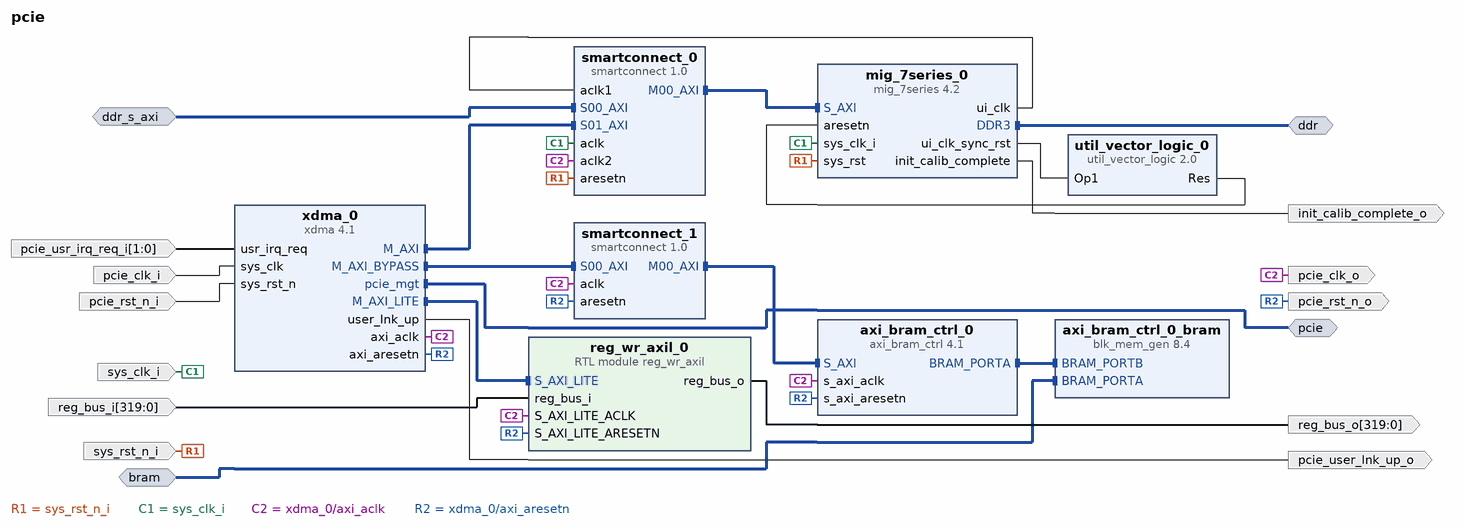
[diagram p0: block diagram of the top level]
# Vivado block design pcie, xc7k325tffg900-2, Vivado 2019.2
create_bd_design pcie

create_bd_intf_port -mode Master -vlnv xilinx.com:interface:ddrx_rtl:1.0 ddr
create_bd_intf_port -mode Master -vlnv xilinx.com:interface:pcie_7x_mgt_rtl:1.0 pcie
create_bd_intf_port -mode Slave -vlnv xilinx.com:interface:bram_rtl:1.0 bram
set_property -dict {CONFIG.MASTER_TYPE BRAM_CTRL} [get_bd_intf_ports bram]
create_bd_intf_port -mode Slave -vlnv xilinx.com:interface:aximm_rtl:1.0 ddr_s_axi
set_property -dict [list \
  CONFIG.DATA_WIDTH 128 \
  CONFIG.PROTOCOL AXI4 \
  CONFIG.FREQ_HZ 200000000 \
  CONFIG.ID_WIDTH 4 \
  CONFIG.ADDR_WIDTH 64 \
  CONFIG.AWUSER_WIDTH 0 \
  CONFIG.ARUSER_WIDTH 0 \
  CONFIG.WUSER_WIDTH 0 \
  CONFIG.RUSER_WIDTH 0 \
  CONFIG.BUSER_WIDTH 0 \
  CONFIG.READ_WRITE_MODE READ_WRITE \
  CONFIG.HAS_BURST 1 \
  CONFIG.HAS_LOCK 1 \
  CONFIG.HAS_PROT 1 \
  CONFIG.HAS_CACHE 1 \
  CONFIG.HAS_QOS 1 \
  CONFIG.HAS_REGION 1 \
  CONFIG.HAS_WSTRB 1 \
  CONFIG.HAS_BRESP 1 \
  CONFIG.HAS_RRESP 1 \
  CONFIG.SUPPORTS_NARROW_BURST 1 \
  CONFIG.NUM_READ_OUTSTANDING 1 \
  CONFIG.NUM_WRITE_OUTSTANDING 1 \
  CONFIG.MAX_BURST_LENGTH 256 \
  CONFIG.NUM_READ_THREADS 1 \
  CONFIG.NUM_WRITE_THREADS 1 \
  CONFIG.RUSER_BITS_PER_BYTE 0 \
  CONFIG.WUSER_BITS_PER_BYTE 0 \
  CONFIG.master_id 0 \
] [get_bd_intf_ports ddr_s_axi]
create_bd_port -dir I -type clk sys_clk_i
set_property -dict {CONFIG.ASSOCIATED_RESET sys_rst_n_i CONFIG.FREQ_HZ 200000000} [get_bd_ports sys_clk_i]
create_bd_port -dir I -type rst sys_rst_n_i
create_bd_port -dir O -type clk pcie_clk_o
create_bd_port -dir O -type rst pcie_rst_n_o
create_bd_port -dir I -from 1 -to 0 pcie_usr_irq_req_i
create_bd_port -dir O init_calib_complete_o
create_bd_port -dir O pcie_user_lnk_up_o
create_bd_port -dir O -from 319 -to 0 reg_bus_o
create_bd_port -dir I -from 319 -to 0 reg_bus_i
create_bd_port -dir I -type clk pcie_clk_i
set_property -dict {CONFIG.ASSOCIATED_RESET pcie_sys_clk_i CONFIG.CLK_DOMAIN pcie_clk_i} [get_bd_ports pcie_clk_i]
create_bd_port -dir I -type rst pcie_rst_n_i

create_bd_cell -type ip -vlnv xilinx.com:ip:xdma:4.1 xdma_0
set_property -dict [list \
  CONFIG.PF0_DEVICE_ID_mqdma 9028 \
  CONFIG.PF2_DEVICE_ID_mqdma 9028 \
  CONFIG.PF3_DEVICE_ID_mqdma 9028 \
  CONFIG.axi_data_width 128_bit \
  CONFIG.axilite_master_en true \
  CONFIG.axist_bypass_en true \
  CONFIG.axisten_freq 250 \
  CONFIG.mode_selection Advanced \
  CONFIG.pf0_class_code_base 05 \
  CONFIG.pf0_class_code_interface 00 \
  CONFIG.pf0_class_code_sub 80 \
  CONFIG.pf0_device_id 7028 \
  CONFIG.pf0_sub_class_interface_menu Generic_XT_compatible_serial_controller \
  CONFIG.pl_link_cap_max_link_speed 5.0_GT/s \
  CONFIG.pl_link_cap_max_link_width X8 \
  CONFIG.plltype QPLL1 \
  CONFIG.xdma_axilite_slave false \
  CONFIG.xdma_num_usr_irq 2 \
  CONFIG.xdma_rnum_chnl 2 \
  CONFIG.xdma_sts_ports false \
  CONFIG.xdma_wnum_chnl 2 \
] [get_bd_cells xdma_0]
create_bd_cell -type ip -vlnv xilinx.com:ip:mig_7series:4.2 mig_7series_0
set_property -dict [list \
  CONFIG.BOARD_MIG_PARAM Custom \
  CONFIG.MIG_DONT_TOUCH_PARAM Custom \
  CONFIG.RESET_BOARD_INTERFACE Custom \
  CONFIG.XML_INPUT_FILE mig_a.prj \
] [get_bd_cells mig_7series_0]
create_bd_cell -type ip -vlnv xilinx.com:ip:axi_bram_ctrl:4.1 axi_bram_ctrl_0
set_property -dict {CONFIG.SINGLE_PORT_BRAM 1} [get_bd_cells axi_bram_ctrl_0]
create_bd_cell -type module -reference reg_wr_axil reg_wr_axil_0
create_bd_cell -type ip -vlnv xilinx.com:ip:smartconnect:1.0 smartconnect_0
set_property -dict {CONFIG.NUM_CLKS 3} [get_bd_cells smartconnect_0]
create_bd_cell -type ip -vlnv xilinx.com:ip:util_vector_logic:2.0 util_vector_logic_0
set_property -dict {CONFIG.C_OPERATION not CONFIG.C_SIZE 1} [get_bd_cells util_vector_logic_0]
create_bd_cell -type ip -vlnv xilinx.com:ip:blk_mem_gen:8.4 axi_bram_ctrl_0_bram
set_property -dict {CONFIG.Memory_Type True_Dual_Port_RAM} [get_bd_cells axi_bram_ctrl_0_bram]
create_bd_cell -type ip -vlnv xilinx.com:ip:smartconnect:1.0 smartconnect_1
set_property -dict {CONFIG.NUM_CLKS 1 CONFIG.NUM_SI 1} [get_bd_cells smartconnect_1]

# ---- connections ----

connect_bd_intf_net [get_bd_intf_pins smartconnect_0/M00_AXI] [get_bd_intf_pins mig_7series_0/S_AXI]
connect_bd_intf_net -intf_net S00_AXI_0_1 [get_bd_intf_ports ddr_s_axi] [get_bd_intf_pins smartconnect_0/S00_AXI]
connect_bd_intf_net [get_bd_intf_pins axi_bram_ctrl_0_bram/BRAM_PORTB] [get_bd_intf_pins axi_bram_ctrl_0/BRAM_PORTA]
connect_bd_intf_net -intf_net BRAM_PORTA_0_1 [get_bd_intf_ports bram] [get_bd_intf_pins axi_bram_ctrl_0_bram/BRAM_PORTA]
connect_bd_intf_net [get_bd_intf_pins xdma_0/M_AXI] [get_bd_intf_pins smartconnect_0/S01_AXI]
connect_bd_intf_net [get_bd_intf_ports ddr] [get_bd_intf_pins mig_7series_0/DDR3]
connect_bd_intf_net [get_bd_intf_ports pcie] [get_bd_intf_pins xdma_0/pcie_mgt]
connect_bd_intf_net [get_bd_intf_pins reg_wr_axil_0/S_AXI_LITE] [get_bd_intf_pins xdma_0/M_AXI_LITE]
connect_bd_intf_net [get_bd_intf_pins axi_bram_ctrl_0/S_AXI] [get_bd_intf_pins smartconnect_1/M00_AXI]
connect_bd_intf_net [get_bd_intf_pins smartconnect_1/S00_AXI] [get_bd_intf_pins xdma_0/M_AXI_BYPASS]
connect_bd_net [get_bd_ports sys_rst_n_i] [get_bd_pins mig_7series_0/sys_rst] [get_bd_pins smartconnect_0/aresetn]
connect_bd_net [get_bd_ports sys_clk_i] [get_bd_pins mig_7series_0/sys_clk_i] [get_bd_pins smartconnect_0/aclk]
connect_bd_net [get_bd_pins mig_7series_0/ui_clk] [get_bd_pins smartconnect_0/aclk1]
connect_bd_net -net usr_irq_req_0_1 [get_bd_ports pcie_usr_irq_req_i] [get_bd_pins xdma_0/usr_irq_req]
connect_bd_net [get_bd_pins mig_7series_0/ui_clk_sync_rst] [get_bd_pins util_vector_logic_0/Op1]
connect_bd_net [get_bd_pins util_vector_logic_0/Res] [get_bd_pins mig_7series_0/aresetn]
connect_bd_net [get_bd_pins mig_7series_0/init_calib_complete] [get_bd_ports init_calib_complete_o]
connect_bd_net [get_bd_pins xdma_0/axi_aclk] \
  [get_bd_pins smartconnect_0/aclk2] [get_bd_pins axi_bram_ctrl_0/s_axi_aclk] [get_bd_pins reg_wr_axil_0/S_AXI_LITE_ACLK] \
  [get_bd_ports pcie_clk_o] [get_bd_pins smartconnect_1/aclk]
connect_bd_net [get_bd_pins xdma_0/axi_aresetn] \
  [get_bd_pins reg_wr_axil_0/S_AXI_LITE_ARESETN] [get_bd_pins axi_bram_ctrl_0/s_axi_aresetn] [get_bd_ports pcie_rst_n_o] \
  [get_bd_pins smartconnect_1/aresetn]
connect_bd_net [get_bd_pins xdma_0/user_lnk_up] [get_bd_ports pcie_user_lnk_up_o]
connect_bd_net [get_bd_pins reg_wr_axil_0/reg_bus_o] [get_bd_ports reg_bus_o]
connect_bd_net -net reg_bus_i_0_1 [get_bd_ports reg_bus_i] [get_bd_pins reg_wr_axil_0/reg_bus_i]
connect_bd_net -net sys_clk_0_1 [get_bd_ports pcie_clk_i] [get_bd_pins xdma_0/sys_clk]
connect_bd_net -net sys_rst_n_0_1 [get_bd_ports pcie_rst_n_i] [get_bd_pins xdma_0/sys_rst_n]

# ---- address map ----
assign_bd_address -offset 0x0000000000000000 -range 8G -target_address_space [get_bd_addr_spaces ddr_s_axi] [get_bd_addr_segs mig_7series_0/memmap/memaddr]
assign_bd_address -offset 0x0000000000000000 -range 8G -target_address_space [get_bd_addr_spaces xdma_0/M_AXI] [get_bd_addr_segs mig_7series_0/memmap/memaddr]
assign_bd_address -offset 0x00000000C0000000 -range 8K -target_address_space [get_bd_addr_spaces xdma_0/M_AXI_BYPASS] [get_bd_addr_segs axi_bram_ctrl_0/S_AXI/Mem0]
assign_bd_address -offset 0x44A00000 -range 512 -target_address_space [get_bd_addr_spaces xdma_0/M_AXI_LITE] [get_bd_addr_segs reg_wr_axil_0/S_AXI_LITE/reg0]

validate_bd_design
save_bd_design
